# EAGLE design Amp Kit v5.3 -2016 (EAGLE 7.2.0)
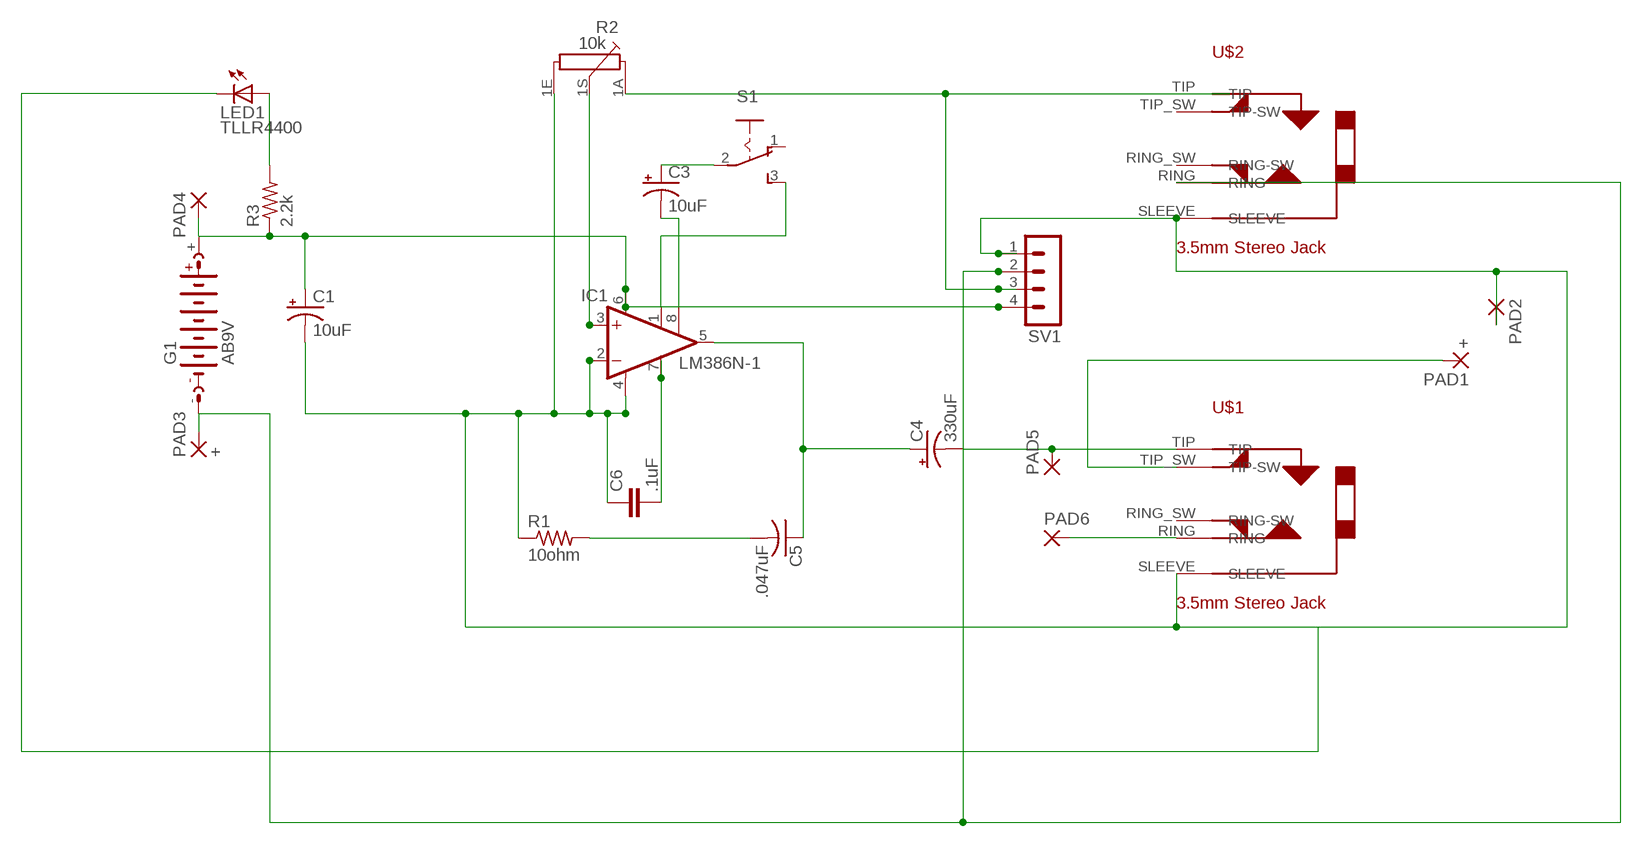
[diagram p0: schematic, sheet 1]

## Parts
C1  10uF  CPOL-USE2-5  [E2-5]
C3  10uF  CPOL-USE2-5  [E2-5]
C4  330uF  CPOL-USE3.5-8  [E3,5-8]
C5  .047uF  C-US050-025X075  [C050-025X075]
C6  .1uF  C-EU050-035X075  [C050-035X075]
G1  AB9V  [AB9V]
IC1  LM386N-1  [DIL08]
LED1  TLLR4400  [LED3MM]
PAD1  +  3,81/1,4  [3,81/1,4]
PAD2  3,81/1,4  [3,81/1,4]
PAD3  +  3,81/1,4  [3,81/1,4]
PAD4  3,81/1,4  [3,81/1,4]
PAD5  SMD2  [SMD1,27-2,54]
PAD6  SMD2  [SMD1,27-2,54]
R1  10ohm  R-US_0207/7  [0207/7]
R2  10k  PC16S  [PC16S]
R3  2.2k  R-US_0207/7  [0207/7]
S1  255SB  [255SB]
SV1  MA04-1  [MA04-1]
U$1  PICAXE_STEREOJACKSOCKET  [PICAXE_STEREOJACKSOCKET]
U$2  PICAXE_STEREOJACKSOCKET  [PICAXE_STEREOJACKSOCKET]

## Nets
N$2: C5.2 R1.2
N$3: R2.1A SV1.3 U$2.TIP
N$4: C4.+ C5.1 IC1.5(OUT)
N$5: IC1.3(+IN) R2.1S
N$6: C1.+ G1.+ IC1.6(VS) PAD4.1(P) R3.1 SV1.4
N$7: C4.- PAD5.1(P) U$1.TIP
N$8: C6.2 IC1.7(BYPASS)
N$9: C3.+ S1.2(P)
N$10: LED1.A R3.2
N$11: IC1.1(GAIN) S1.3(S)
N$12: C1.- C6.1 IC1.2(-IN) IC1.4(GND) LED1.K(C) PAD2.1(P) R1.1 R2.1E SV1.1 U$1.SLEEVE U$2.SLEEVE
N$13: G1.- PAD3.1(P) SV1.2 U$2.RING
N$14: PAD6.1(P) U$1.RING
N$15: C3.- IC1.8(GAIN)
N$16: PAD1.1(P) U$1.TIP_SW(TIP-SW)
Unconnected: S1.1(O) U$1.RING_SW(RING-SW) U$2.RING_SW(RING-SW) U$2.TIP_SW(TIP-SW)

## Library data of the parts
C1 C3 C4 = rcl:CPOL-US: POLARIZED CAPACITOR, American symbol
C5 = rcl:C-US: CAPACITOR, American symbol
C6 = rcl:C-EU: CAPACITOR, European symbol
G1 = _horizontal_battery_SAIC:AB9V: 9-V BATTERY CLIP
IC1 = linear:LM386?-*: Low Voltage Audio Power Amplifier Source: http://cache.national.com/ds/LM/LM386.pdf
LED1 = led:TLLR4400: Low Current (2mA) LED 3 mm Tinted Diffused Package color RED Source: Data sheet <http://www.farnell.com/datasheets/391100.pdf>; MF: VISHAY SEMICONDUCTOR; OC_FARNELL: 1612437
PAD1-PAD4 = wirepad:3,81/1,4: THROUGH-HOLE PAD
PAD5 PAD6 = wirepad:SMD2: SMD PAD
R1 R3 = rcl:R-US_: RESISTOR, American symbol
R2 = piherUPDATE:PC16S: POTENTIOMETER single carbon potentiometer, 16 mm, S3ROH; OC_FARNELL: 4452940; OC_NEWARK: unknown
S1 = switchUPDATE:255SB: SLIDING SWITCH Distributor Buerklin, 11G810
SV1 = con-lstb:MA04-1: PIN HEADER; OC_FARNELL: unknown; OC_NEWARK: unknown
U$1 U$2 = StereoJackSocket:PICAXE_STEREOJACKSOCKET

## Board
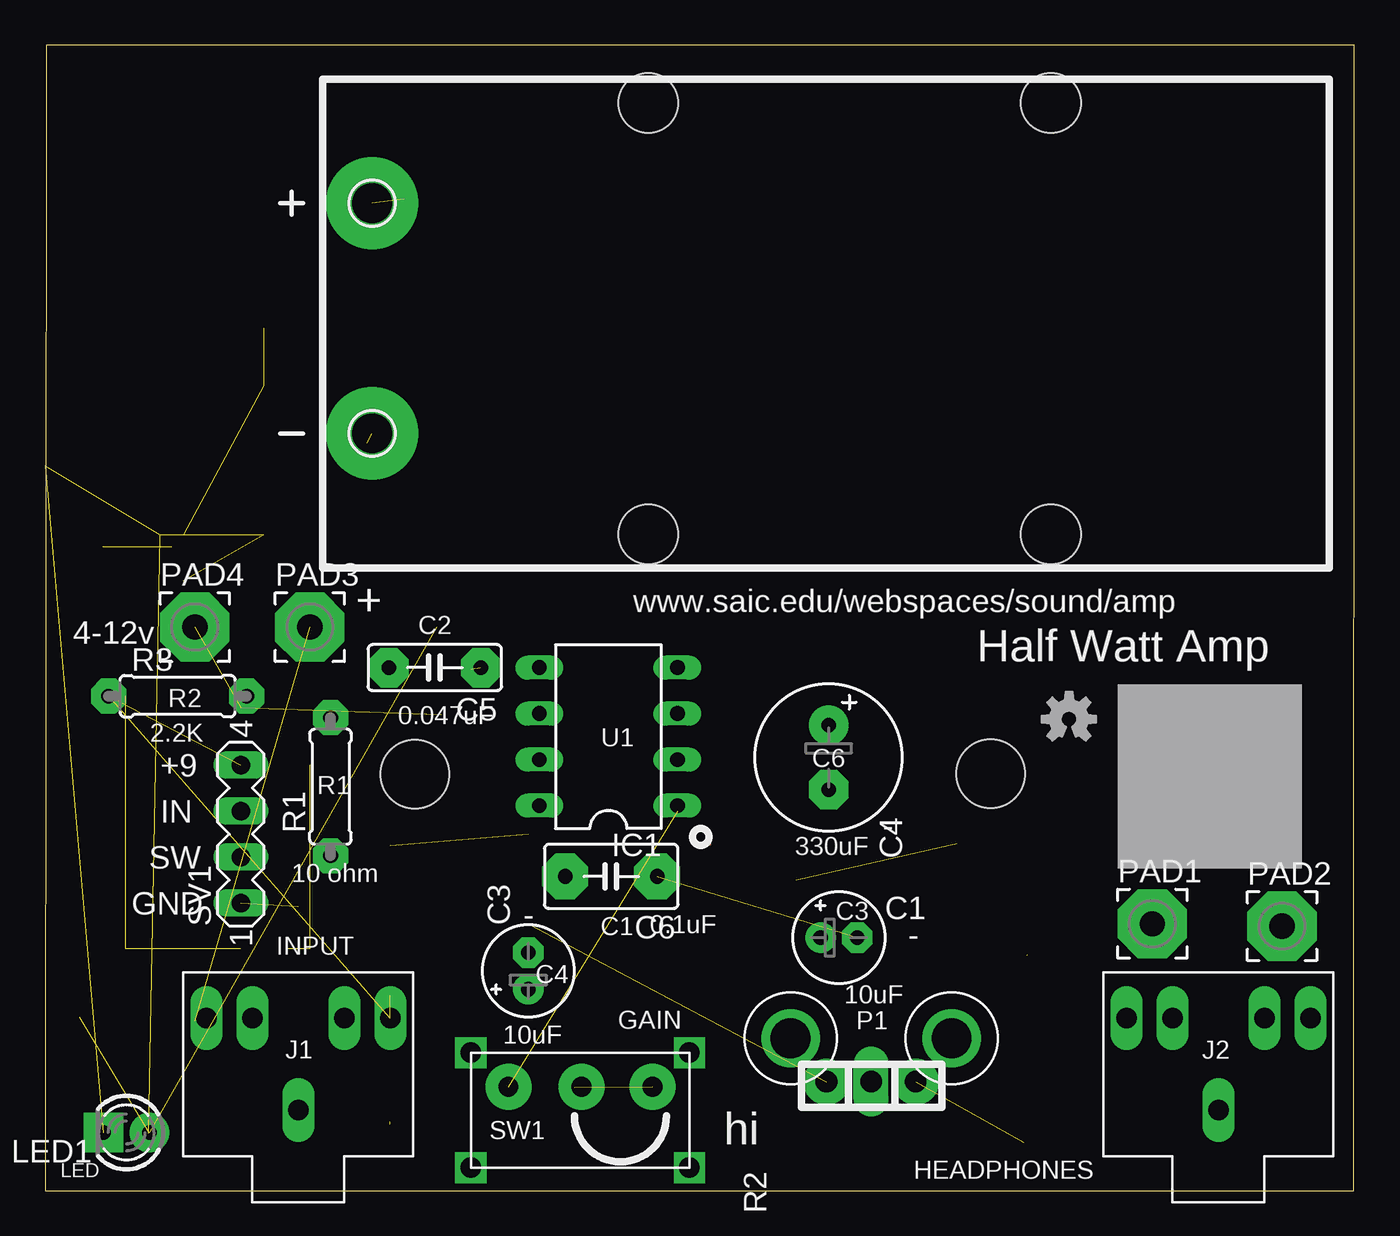
[diagram p1: board, top side]
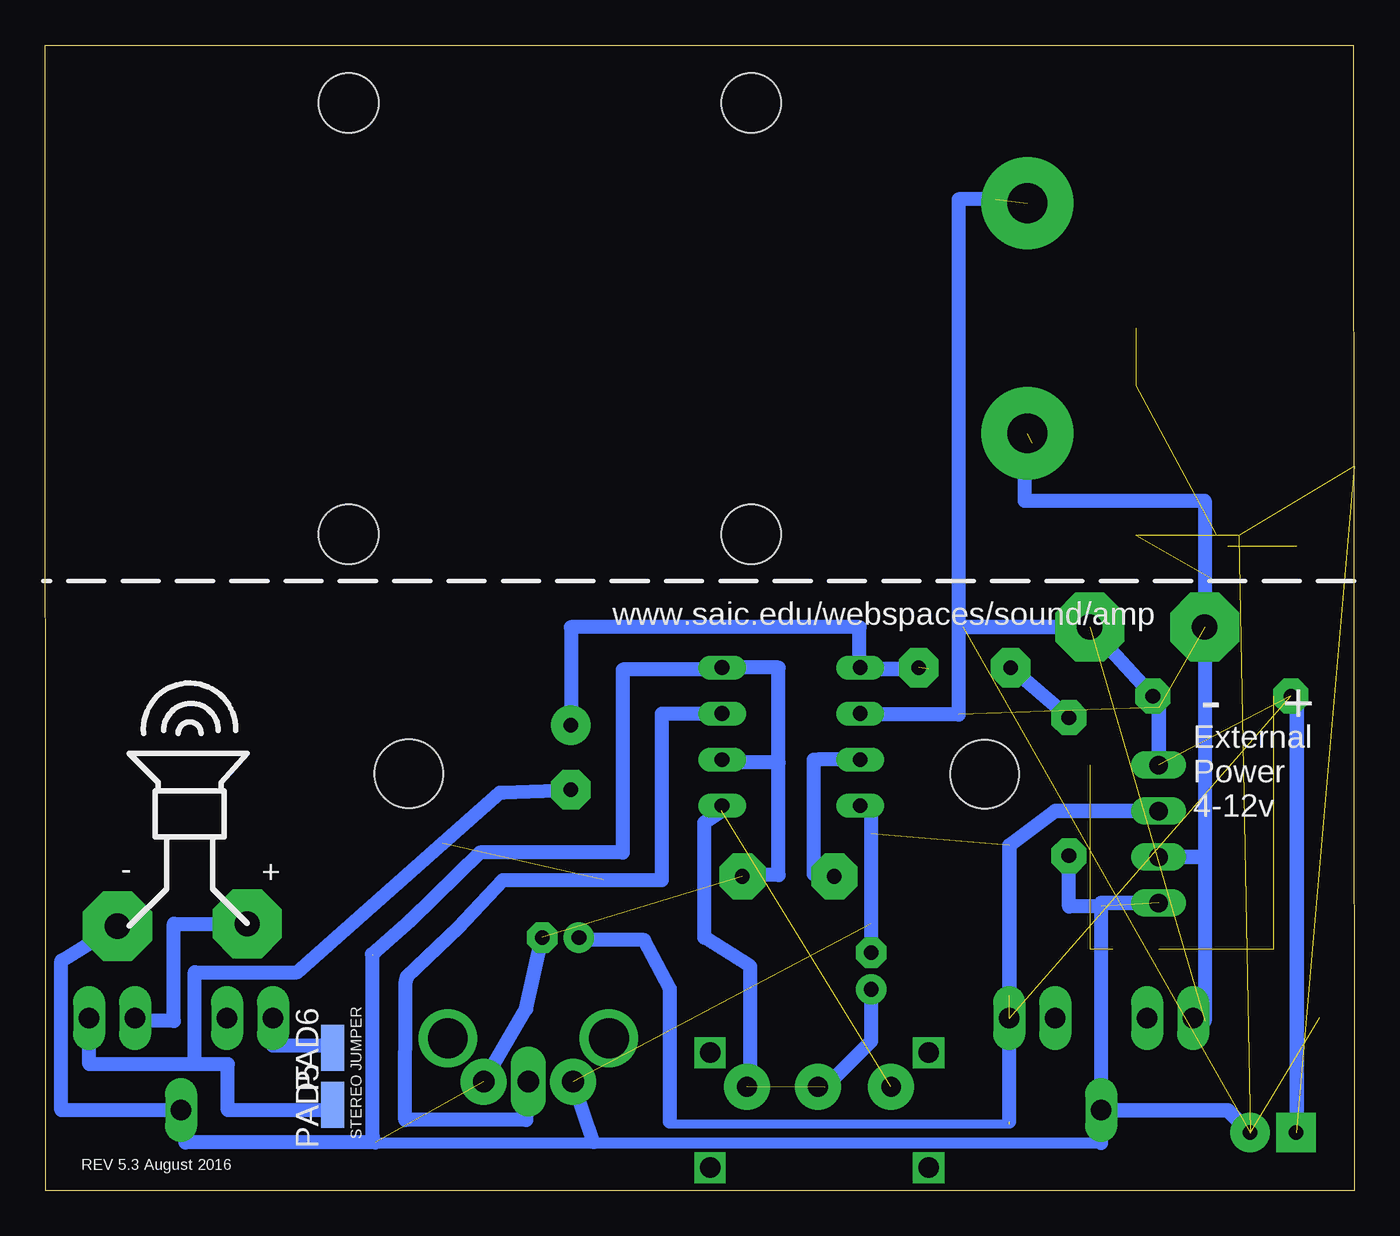
[diagram p2: board, bottom side, seen from below]

Size 72.26 x 63.24 mm. Coordinates in mm from the lower left corner, seen from the top.
Outline: 0,0 72.24,0 72.26,63.24 0.05,63.24 0,0
Copper layers (1*16): Top 0.035mm / dielectric 1.5mm / Bottom 0.035mm
Design rules "default": minimum track width 10mil, minimum drill 24mil, track to track 8mil, track to pad 8mil, pad to pad 8mil, via to via 8mil, smd to smd 8mil, copper to edge 40mil, drill to drill 8mil, minimum pad ring 10mil, minimum via ring 8mil, stop-mask expansion 4mil, vias tented up to drill 0mil, thermal gap 10mil
Holes 3.78 mm at 52.18,23.02 20.4,23
Holes 3.3 mm at 33.29,36.23 55.51,36.23 55.51,60.06 33.29,60.06

### Footprints (pad centres in the part's own frame; a part is rotated, then mirrored left to right if it is on the bottom)
E2-5 = drill 0.813 pad 1.676: + -1.016,0 | drill 0.813 pad 1.676 octagon: - 1.016,0
E3,5-8 = drill 0.813 pad 2.184: + -1.778,0 | drill 0.813 pad 2.184 octagon: - 1.778,0
C050-025X075 = drill 0.813 pad 2.184 octagon: 1 -2.54,0; 2 2.54,0
C050-035X075 = drill 0.813 pad 2.54 octagon: 1 -2.54,0; 2 2.54,0
AB9V = drill 2.2 pad 5.08: + 0,10.16; - 0,-2.54
DIL08 = drill 0.813 pad 1.27 long: 1 -3.81,-3.81; 2 -1.27,-3.81; 3 1.27,-3.81; 4 3.81,-3.81; 5 3.81,3.81; 6 1.27,3.81; 7 -1.27,3.81; 8 -3.81,3.81
LED3MM = drill 0.813 pad 2.184: A -1.27,0 | drill 0.813 pad 2.184 square: K 1.27,0
3,81/1,4 = drill 1.397 pad 3.81 octagon: 1 0,0
SMD1,27-2,54 = smd 1.27 x 2.54: 1 0,0
0207/7 = drill 0.813 pad 1.93 octagon: 1 -3.81,0; 2 3.81,0
PC16S = drill 1.2 pad 2.54: 1A -5,7.77; 1E -0.08,7.77 | drill 1.2 pad 1.93 long: 1S -2.54,7.77 | drill 2.2 pad 3.175: P$1 -6.985,10.16; P$2 1.905,10.16
255SB = drill 1.1 pad 2.54: 1 1.033,0.663; 2 4.939,0.66; 3 -3.01,0.658 | drill 1.143 square: P$1 -5.08,2.54; P$2 6.985,2.54; P$5 -5.08,-3.81; P$6 6.985,-3.81
MA04-1 = drill 1.016 long: 1 -3.81,0; 2 -1.27,0; 3 1.27,0; 4 3.81,0
PICAXE_STEREOJACKSOCKET = drill 1.143 pad 1.778 long: RING -5.08,-5.08; RING_SW -5.08,-2.54; SLEEVE 0,0; TIP -5.08,5.08; TIP_SW -5.08,2.54

### Placement (x,y rotation side)
C1  43.81,13.97 0 top
C3  26.67,12.13 90 top
C4  43.24,23.91 270 top
C5  21.5,28.87 180 top
C6  31.24,17.35 180 top
G1  18.05,44.35 0 top
IC1  31.09,25.07 90 top
LED1  4.48,3.21 180 top
PAD1  61.12,14.73 0 top
PAD2  68.28,14.61 0 top
PAD3  14.61,31.12 0 top
PAD4  8.26,31.12 0 top
PAD5  56.39,4.75 0 bottom
PAD6  56.39,7.87 0 bottom
R1  15.75,22.3 90 top
R2  48.13,-1.75 0 top
R3  7.3,27.3 0 top
S1  28.57,5.08 0 top
SV1  10.79,19.68 90 top
U$1  64.77,4.44 270 top
U$2  13.97,4.44 270 top
U$3  [OSHW-LOGO-S]  56.51,26.04 0 top

### Tracks (layer width: path | path; a pad name or v marks a point on that pad's centre or on a via)
N$1  (1 unrouted)
  Bottom 0.406: 54.23,13.06 54.2,12.98
  Bottom 0.762: 54.19,2.98 54.19,13.01 | 34.47,28.77 40.39,28.77 40.39,18.67 48.26,18.67 52.09,14.94 54.23,13.06
N$2
  Bottom 0.762: C5.2 R1.2
N$3  (3 unrouted)
  Bottom 0.406: 26.67,14.73 26.67,19.68
  Bottom 0.762: 41.99,2.67 R2.1A
  Bottom 0.813: 19.05,10.79 19.05,19.05 16.51,20.95 SV1.3
N$4  (1 unrouted)
  Bottom 0.406: 27.3,28.88 IC1.5 27.28,28.83
  Bottom 0.61: 27.28,28.81 IC1.5
  Bottom 0.762: 27.3,28.88 27.3,31.12 43.24,31.12 C4.+
  Bottom 0.813: 23.5,28.79 24.69,28.81 25.88,28.81 27.28,28.81
N$5
  Bottom 0.406: 52.36,11.56 52.31,11.81
  Bottom 0.762: 52.31,11.75 52.36,11.56 52.39,3.91 45.72,3.91 R2.1S | IC1.3 38.23,26.34 38.23,17.14 46.99,17.14 49.45,14.53 52.31,11.81
N$6  (6 unrouted)
  Bottom 0.406: 37.64,3.67 37.78,3.81 | 27.28,26.29 IC1.6
  Bottom 0.508: 19.03,3.67 37.64,3.67
  Bottom 0.762: C1.+ 42.61,13.84 39.2,13.84 37.78,11.15 37.78,3.81 | 19.05,3.81 19.05,9.53 | 19.81,54.74 21.84,54.74 21.84,26.29 27.28,26.29
  Bottom 0.813: SV1.4 10.79,26.67
N$7  (1 unrouted)
  Bottom 0.406: PAD5.1 56.51,4.44
  Bottom 0.762: C4.- 46.98,21.98 47.18,21.97 50.34,19.17 58.36,12.07 64.01,12.07 64.01,6.99 | 64.01,6.99 62.19,6.99 62.19,4.44 56.51,4.44 | U$1.TIP 69.83,6.99 64.01,6.99
N$8
  Bottom 0.406: 29.63,23.8 29.84,23.8 | 28.7,17.46 C6.2
  Bottom 0.762: IC1.7 29.63,23.8 | 29.84,23.8 29.84,17.46 28.7,17.46
N$9  (1 unrouted)
  Bottom 0.406: S1.2 33.65,6.37
  Bottom 0.762: 34.92,20.95 35.88,20.32 35.88,13.97 33.34,12.38 33.34,6.67 S1.2 | C3.+ 26.67,8.26 29.21,5.71
N$10  (2 unrouted)
  Bottom 0.813: R3.2 14.61,31.12 21.59,31.12
N$11  (1 unrouted)
  Bottom 0.406: 34.9,20.98 34.92,20.95
  Bottom 0.762: IC1.1 34.9,20.98
N$12  (6 unrouted)
  Bottom 0.406: 33.26,17.35 32.94,17.42 33.04,17.42 | 34.9,23.63 IC1.2 | 64.52,4.44 U$1.SLEEVE | 54.13,2.62 54.04,2.67
  Bottom 0.61: 13.97,2.62 54.13,2.62
  Bottom 0.762: 13.97,15.69 U$2.SLEEVE 13.97,2.62 | 13.97,15.88 13.97,15.69 | 13.97,15.69 15.75,15.69 R1.1 | R2.1E 45.72,10.04 C1.- | PAD2.1 71.37,12.7 71.37,4.44 U$1.SLEEVE | 33.26,17.35 C6.1 | 31.78,23.63 34.9,23.63 | IC1.4 31.78,28.88 31.78,23.63 | 32.94,17.42 31.78,17.42 31.78,23.63 | 64.52,4.44 64.52,2.67 54.04,2.67
  Bottom 0.813: U$2.SLEEVE 6.99,4.44 5.71,3.17 | 13.97,15.88 SV1.1
N$13  (2 unrouted)
  Bottom 0.406: 8.26,9.37 U$2.RING
  Bottom 0.762: 18.19,40.62 18.2,38.09 8.26,38.1 8.26,18.41 8.26,9.37
  Bottom 0.813: 18.19,40.62 17.78,41.27 | SV1.2 8.26,18.41
N$14
  Bottom 0.406: PAD6.1 56.51,7.87 56.51,8
  Bottom 0.762: 56.51,8 59.69,8 U$1.RING
N$15
  Bottom 0.762: IC1.8 26.67,21.26 C3.-
N$16
  Bottom 0.406: 67.31,9.37 U$1.TIP_SW
  Bottom 0.762: PAD1.1 65.17,14.73 65.17,9.37 67.31,9.37
N$17  (1 unrouted)
N$18  (4 unrouted)
N$19  (2 unrouted)
N$20  (2 unrouted)
N$22  (1 unrouted)
N$23
  Bottom 0.813: 3.18,3.17 3.18,26.67

### Text on the board
Top: .
tPlace: + | C2 | www.saic.edu/webspaces/sound/amp | 4-12v | Half Watt Amp | R2 | 0.047uF | 2.2K | U1 | C6 | +9 | R1 | - | IN | 330uF | SW | 10 ohm | - | GND | C3 | C1 | 0.1uF | INPUT | - | C4 | 10uF | 10uF | GAIN | P1 | J1 | J2 | SW1 | hi | LED | HEADPHONES
bPlace: www.saic.edu/webspaces/sound/amp | - | + | External / Power / 4-12v | + | - | STEREO JUMPER | REV 5.3 August 2016